# EAGLE design BLE112 Breakout Board v2.2 (EAGLE 7.2.0)
BLE112 Breakout Board v2.0 Full breakout board for all BLE112 functions, with optional LEDs, programming header, USB access, etc.
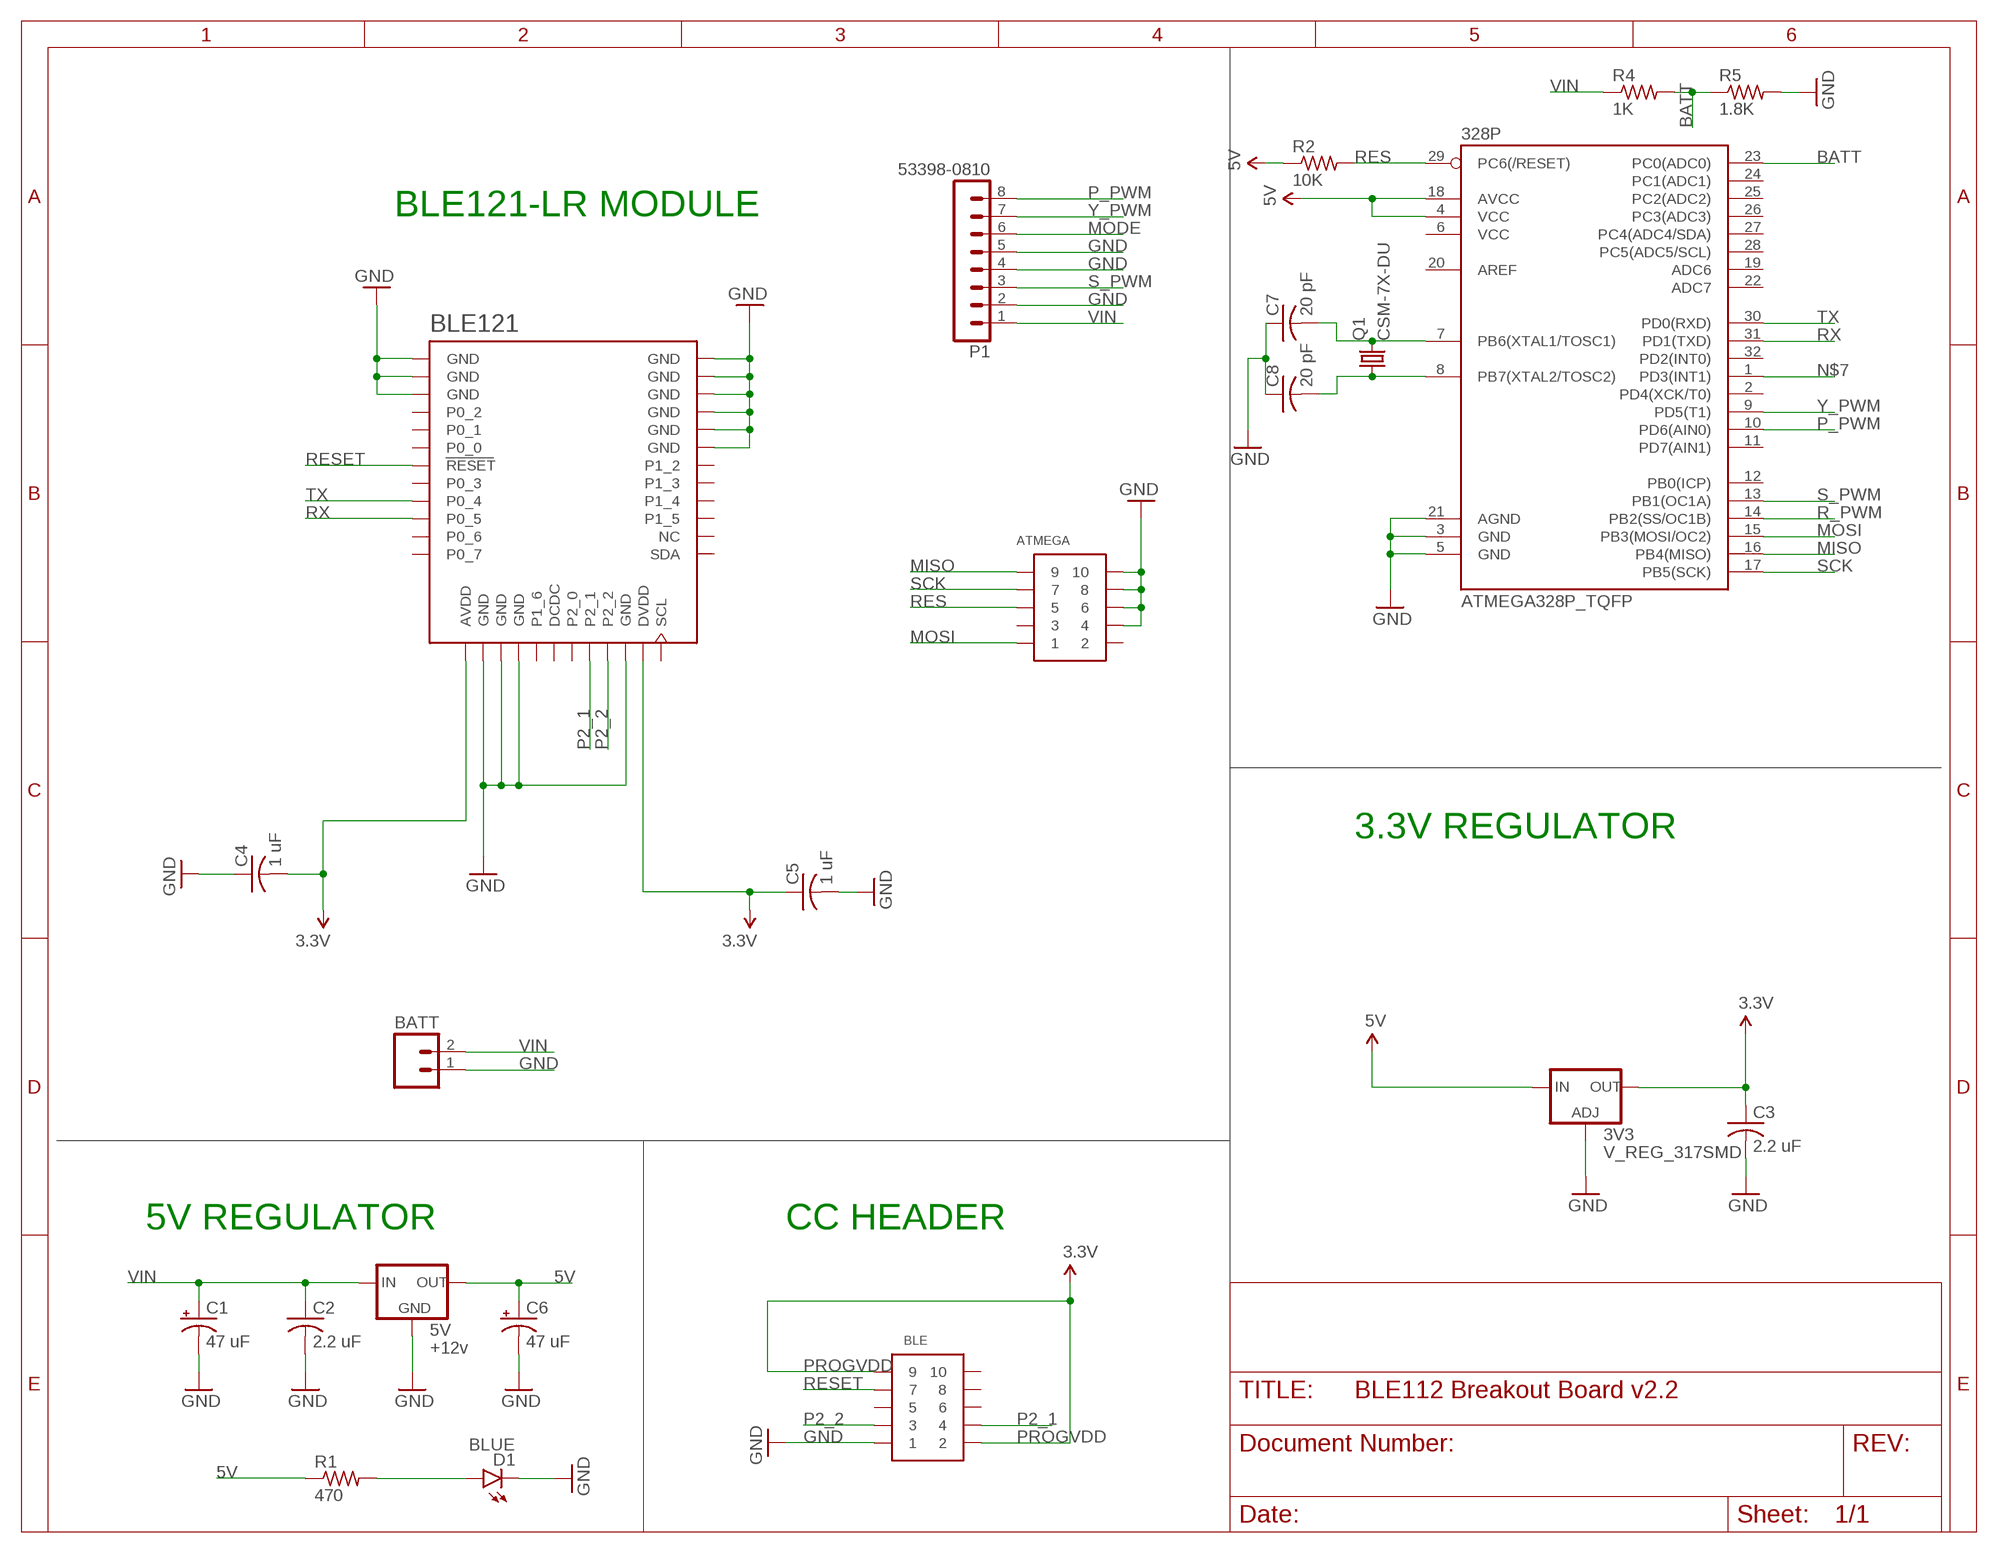
[diagram p0: schematic, sheet 1]

## Parts
3V3  V_REG_317SMD  [SOT223]
5V  +12v  V_REG_78XX7812  [TO-252]
328P  ATMEGA328P_TQFP  [TQFP32-08]
ATMEGA  CONN_5-2-FTSH-V  [FTSH-105-DV]
BATT  M02JST-PTH-2  [JST-2-PTH]
BLE  CONN_5-2-FTSH-V  [FTSH-105-DV]
BLE121  BLE121LR-VISUAL-A  [BLE121LR-A]
C1  47 uF  CPOL-US153CLV-0405  [153CLV-0405]
C2  2.2 uF  C-USC0402  [C0402]
C3  2.2 uF  C-USC0402  [C0402]
C4  1 uF  C-USC0402  [C0402]
C5  1 uF  C-USC0402  [C0402]
C6  47 uF  CPOL-US153CLV-0405  [153CLV-0405]
C7  20 pF  C-USC0402  [C0402]
C8  20 pF  C-USC0402  [C0402]
D1  BLUE  LED-BLUE0603  [LED-0603]
P1  53398-0810  [53398-0810]
Q1  CSM-7X-DU  [CSM-7X-DU]
R1  470  R-US_R0402  [R0402]
R2  10K  R-US_R0402  [R0402]
R4  1K  R-US_R0402  [R0402]
R5  1.8K  R-US_R0402  [R0402]

## Nets
5V [power]: 3V3.3(IN) 5V.2(OUT) 328P.4(VCC) 328P.18(AVCC) C6.+ R1.1 R2.1
BATT: 328P.23(PC0(ADC0)) R4.2 R5.1
GND [power]: 3V3.1(ADJ) 5V.3(GND) 328P.3(GND) 328P.5(GND) 328P.21(AGND) ATMEGA.4 ATMEGA.6 ATMEGA.8 ATMEGA.10 BATT.1 BLE121.GND BLE121.GND@2(GND) BLE121.GND@3(GND) BLE121.GND@4(GND) BLE121.GND@5(GND) BLE121.GND@6(GND) BLE121.GND@7(GND) BLE121.GND@8(GND) BLE121.GND@9(GND) BLE121.GND@10(GND) BLE121.GND@11(GND) BLE121.GND@12(GND) BLE121.GND@13(GND) BLE.1 C1.- C2.2 C3.2 C4.1 C5.2 C6.- C7.1 C8.1 D1.C P1.2 P1.4 P1.5 R5.2
MISO: 328P.16(PB4(MISO)) ATMEGA.9
MODE: P1.6
MOSI: 328P.15(PB3(MOSI/OC2)) ATMEGA.1
N$1: D1.A R1.2
N$2: 328P.7(PB6(XTAL1/TOSC1)) C7.2 Q1.2
N$3: 328P.8(PB7(XTAL2/TOSC2)) C8.2 Q1.1
N$7: 328P.1(PD3(INT1))
P2_1: BLE121.P2_1 BLE.4
P2_2: BLE121.P2_2 BLE.3
P_PWM: 328P.10(PD6(AIN0)) P1.8
PROGVDD [power]: 3V3.2(OUT) BLE121.AVDD BLE121.DVDD BLE.2 BLE.9 C3.1 C4.2 C5.1 ; supply symbol labelled 3.3V
R_PWM: 328P.14(PB2(SS/OC1B))
RES: 328P.29(PC6(/RESET)) ATMEGA.5 R2.2
RESET: BLE121.RESET BLE.7
RX: 328P.31(PD1(TXD)) BLE121.P0_5
S_PWM: 328P.13(PB1(OC1A)) P1.3
SCK: 328P.17(PB5(SCK)) ATMEGA.7
TX: 328P.30(PD0(RXD)) BLE121.P0_4
VIN: 5V.1(IN) BATT.2 C1.+ C2.1 P1.1 R4.1
Y_PWM: 328P.9(PD5(T1)) P1.7
Unconnected: 328P.2(PD4(XCK/T0)) 328P.6(VCC) 328P.11(PD7(AIN1)) 328P.12(PB0(ICP)) 328P.19(ADC6) 328P.20(AREF) 328P.22(ADC7) 328P.24(PC1(ADC1)) 328P.25(PC2(ADC2)) 328P.26(PC3(ADC3)) 328P.27(PC4(ADC4/SDA)) 328P.28(PC5(ADC5/SCL)) 328P.32(PD2(INT0)) ATMEGA.2 ATMEGA.3 BLE121.DCDC BLE121.NC BLE121.P0_0 BLE121.P0_1 BLE121.P0_2 BLE121.P0_3 BLE121.P0_6 BLE121.P0_7 BLE121.P1_2 BLE121.P1_3 BLE121.P1_4 BLE121.P1_5 BLE121.P1_6 BLE121.P2_0 BLE121.SCL BLE121.SDA BLE.5 BLE.6 BLE.8 BLE.10

## Notes on the sheet
- BLE121-LR MODULE
- 3.3V REGULATOR
- 5V REGULATOR | CC HEADER

## Library data of the parts
3V3 = SparkFun-PowerIC:V_REG_317: Voltage Regulator Standard LM317 adjustable voltage regulator. AOI (Adjust Output Input). Google 'LM317 Calculator' for easy to use app to get the two resistor values needed. 240/720 for 5V output. 240/390 for 3.3V output. Spark Fun Electronics SKU : COM-00527
5V = SparkFun-PowerIC:V_REG_78XX: Voltage Regulator Standard 78xx regulator. IGO (Input Ground Output). Spark Fun Electronics SKU : COM-00107; PROD_ID: VREG-12370
328P = SparkFun-DigitalIC:ATMEGA328P_TQFP; PROD_ID: IC-09069
ATMEGA BLE = pel_misc:CONN_5-2
BATT = SparkFun-Connectors:M02: Standard 2-pin 0.1" header. Use with - straight break away headers ( PRT-00116) - right angle break away headers (PRT-00553) - swiss pins (PRT-00743) - machine pins (PRT-00117) - female headers (PRT-00115) Molex polarized connector foot print use with: PRT-08233 with associated crimp pins and housings. 2.54_SCREWTERM for use with PRT-10571. 3.5mm Screw Terminal footprints for PRT-08084 5mm Screw Terminal footprints for use with PRT-08432; PROD_ID: CONN-09863; SKU: PRT-09914
BLE121 = sf-bluegiga:BLE121LR-VISUAL: Bluetooth Low Energy single-mode long-range module - Bluetooth 4.0 (CC2541). BLE121LR-A variant has an on-module ceramic chip antenna. BLE121LR-A variant includes keepout/restrict area. Antenna edge of the module should be flush up against the edge of the PCB. See datasheet for variant layout details. IT IS EXTREMELY IMPORTANT THAT YOU FOLLOW THE LAYOUT GUIDELINES FOR THIS MODULE IN ORDER TO ENSURE MAXIMUM RANGE. THIS MEANS THAT YOU NEED A SOLID GROUND PLANE EXTENDING AT LEAST 17 mm ON THE LEFT AND RIGHT SIDES OF THE MODULE, AS SHOWN IN THE DATASHEET. BLE121LR is a Bluetooth Smart Long Range module targeted for Bluetooth Smart applications where the best possible RF performance and range are required. At +8 dBm TX power and -98 dBm sensitivity BLE121LR has best-in-class RF performance and can provide Bluetooth Smart connectivity up to 450 meters. BLE121LR integrates all features required for a Bluetooth Smart application: Bluetooth radio, software stack and GATT based profiles. and it can also host end user applications, which means no external micro controller is required in size, price or power constrained devices. BLE121LR Bluetooth Smart module also has flexible hardware interfaces to connect to different peripherals or sensors. Although BLE121LR Bluetooth Smart Long Range Module is target for applications requiring high RF performance, it is still has relatively low power consumption and can be power using a standard 3V coin cell batteries. https://www.bluegiga.com/en-US/products/bluetooth-4.0-modules/ble121lr-bluetooth--smart-long https://github.com/jrowberg/sf-oshw Last updated 2014-08-02 by Jeff Rowberg <jeff@rowberg.net>; ANTENNA: On-module ceramic chip antenna
C1 C6 = adafruit:CPOL-US: POLARIZED CAPACITOR, American symbol
C2 C7 C8 = adafruit:C-US: CAPACITOR, American symbol
C3-C5 = resistor:C-US: CAPACITOR, American symbol
D1 = SparkFun-LED:LED-BLUE: Blue LEDs for production use Various blue LEDs stocked by SparkFun production 0603 - DIO-08575 Rebel - DIO-09553 1206 - DIO-09911; PROD_ID: DIO-08575
P1 = con-molex-picoblade:53398-0810: HEADER
Q1 = crystal:CSM-7X-DU: SMD CRYSTAL Source: www.ecsxtal.com .. Crystal 3.6864MHz CSM_7X_DU.PDF; OC_FARNELL: unknown; OC_NEWARK: unknown
R1 = resistor:R-US_: RESISTOR, American symbol
R2 R4 R5 = adafruit:R-US_: RESISTOR, American symbol

## Net classes
0 default: width 0.152 mm, drill 0.33 mm, clearance 0.152 mm
1 power: width 0.254 mm, drill 0.33 mm, clearance 0.152 mm

## Board
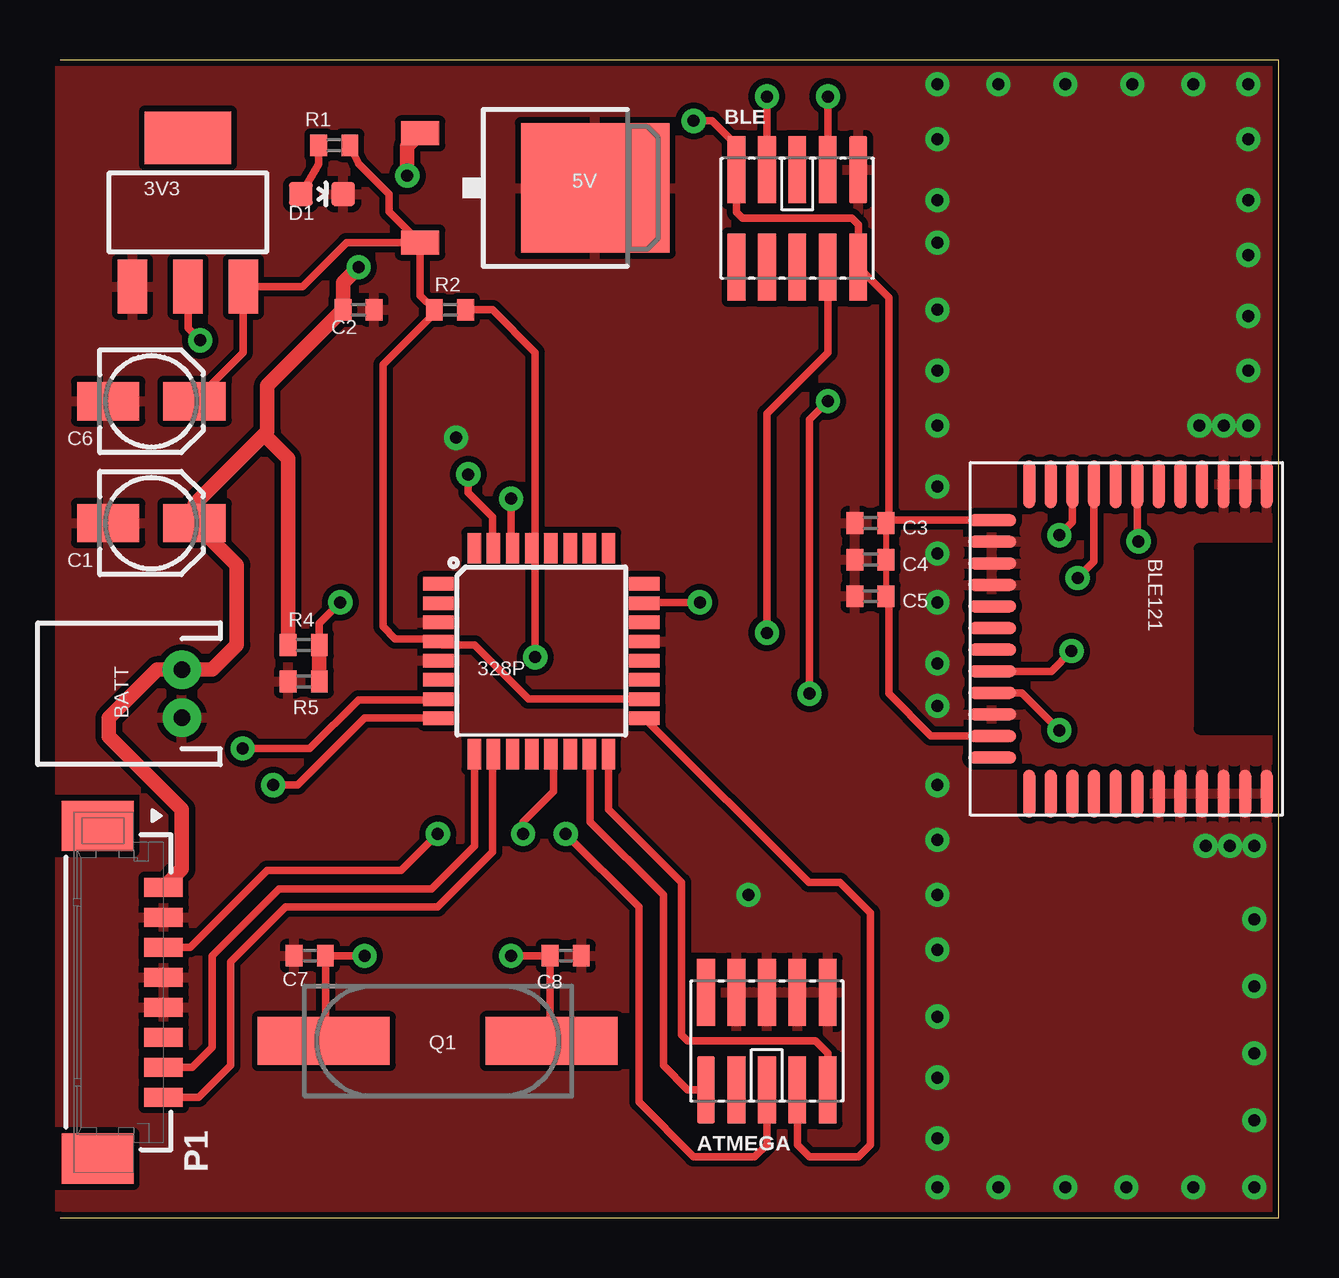
[diagram p1: board, top side]
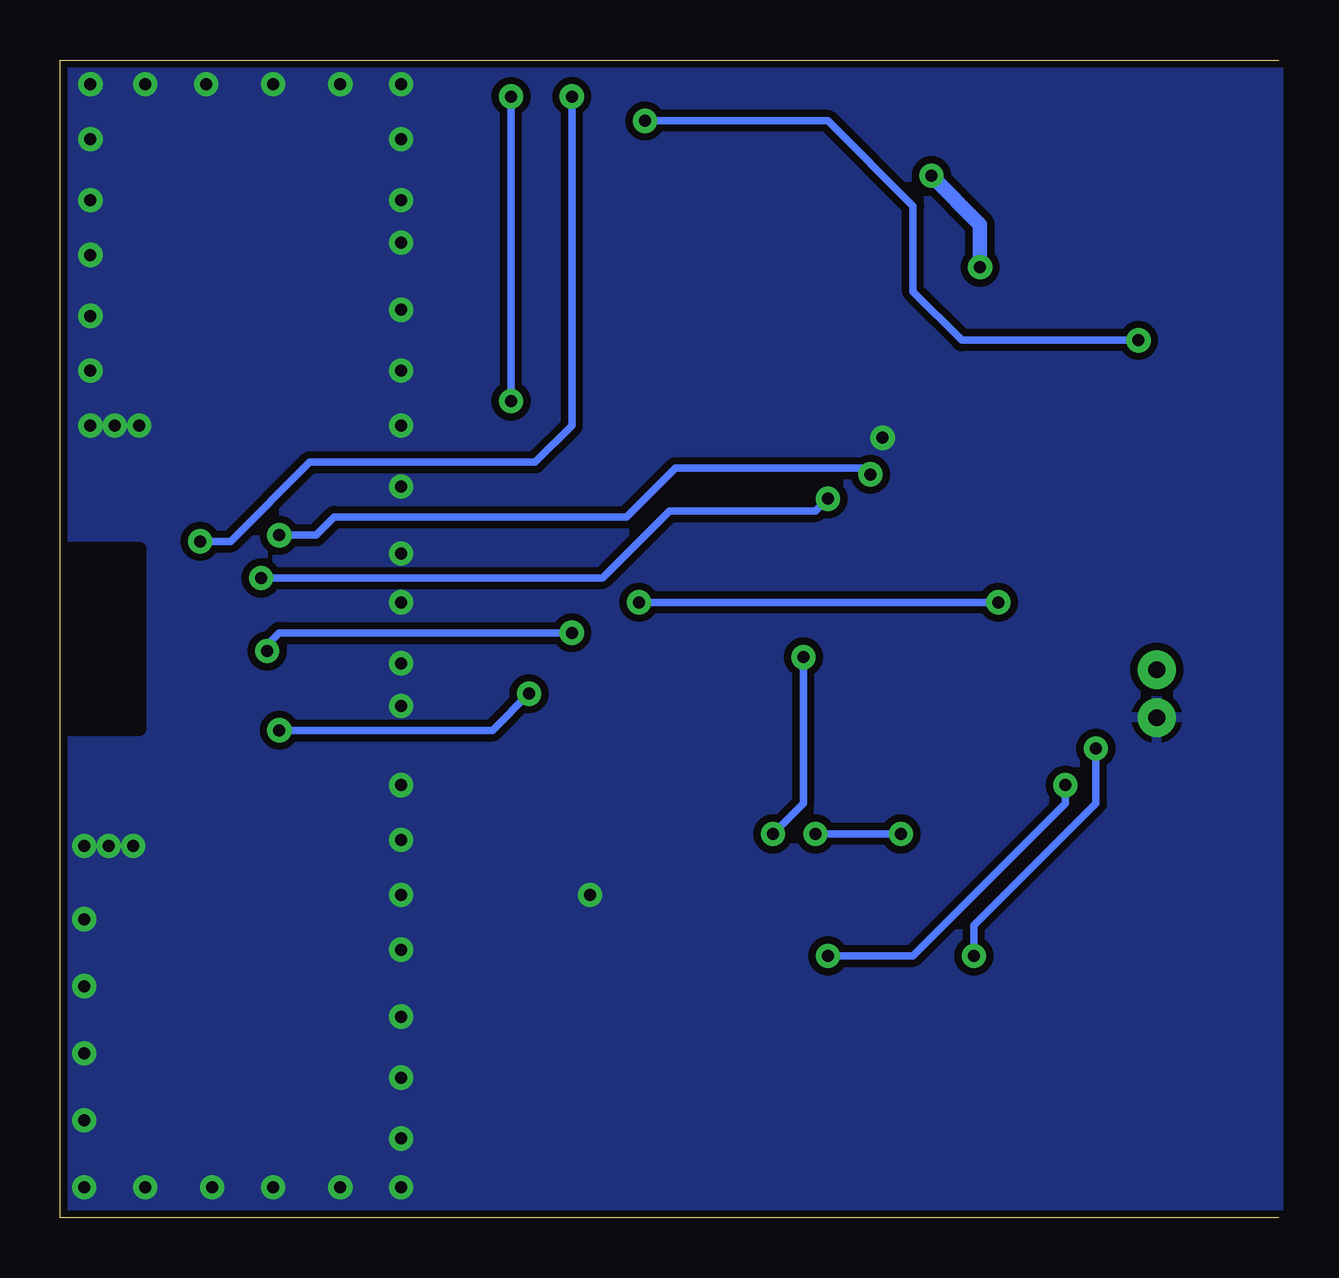
[diagram p2: board, bottom side, seen from below]

Size 50.8 x 48.26 mm. Coordinates in mm from the lower left corner, seen from the top.
Outline: 0,0 50.8,0 50.8,48.26 0,48.26
Copper layers (1*16): Top 0.035mm / dielectric 1.5mm / Bottom 0.035mm
Design rules "SparkFun": minimum track width 8mil, minimum drill 20mil, track to track 8mil, track to pad 8mil, pad to pad 8mil, via to via 8mil, smd to smd 8mil, copper to edge 8mil, drill to drill 8mil, minimum pad ring 12mil, minimum via ring 10mil, stop-mask expansion 4mil, vias tented up to drill 20mil, thermal gap 10mil

### Footprints (pad centres in the part's own frame; a part is rotated, then mirrored left to right if it is on the bottom)
SOT223 = smd 1.219 x 2.235: 1 -2.311,-3.099; 2 0,-3.099; 3 2.311,-3.099 | smd 3.6 x 2.2: 4 0,3.099
TO-252 = smd 1 x 1.6: 1 -2.28,-4.8; 2 2.28,-4.8 | smd 5.4 x 6.2: 3 0,2.5
TQFP32-08 = smd 1.27 x 0.559: 1 -4.293,2.8; 2 -4.293,2; 3 -4.293,1.2; 4 -4.293,0.4; 5 -4.293,-0.4; 6 -4.293,-1.2; 7 -4.293,-2; 8 -4.293,-2.8; 17 4.293,-2.8; 18 4.293,-2; 19 4.293,-1.2; 20 4.293,-0.4; 21 4.293,0.4; 22 4.293,1.2; 23 4.293,2; 24 4.293,2.8 | smd 0.559 x 1.27: 9 -2.8,-4.293; 10 -2,-4.293; 11 -1.2,-4.293; 12 -0.4,-4.293; 13 0.4,-4.293; 14 1.2,-4.293; 15 2,-4.293; 16 2.8,-4.293; 25 2.8,4.293; 26 2,4.293; 27 1.2,4.293; 28 0.4,4.293; 29 -0.4,4.293; 30 -1.2,4.293; 31 -2,4.293; 32 -2.8,4.293
FTSH-105-DV = smd 0.74 x 2.8: 1 -2.54,-2.03; 2 -2.54,2.03; 3 -1.27,-2.03; 4 -1.27,2.03; 5 0,-2.03; 6 0,2.03; 7 1.27,-2.03; 8 1.27,2.03; 9 2.54,-2.03; 10 2.54,2.03
JST-2-PTH = drill 0.7 pad 1.6: 1 -1,0; 2 1,0
BLE121LR-A = smd 0.5 x 2: AVDD -4.95,-5.6; DCDC -0.45,-5.6; DVDD 4.05,-5.6; GND@4 -4.05,-5.6; GND@5 -3.15,-5.6; GND@6 -2.25,-5.6; GND@7 3.15,-5.6; P1_6 -1.35,-5.6; P2_0 0.45,-5.6; P2_1 1.35,-5.6; P2_2 2.25,-5.6; SCL 4.95,-5.6 | smd 2 x 0.5: GND -6.45,5.85; GND@2 -6.45,4.95; GND@3 -6.45,4.05; GND@8 6.45,1.35; GND@9 6.45,2.25; GND@10 6.45,3.15; GND@11 6.45,4.05; GND@12 6.45,4.95; GND@13 6.45,5.85; NC 6.45,-3.15; P0_0 -6.45,1.35; P0_1 -6.45,2.25; P0_2 -6.45,3.15; P0_3 -6.45,-0.45; P0_4 -6.45,-1.35; P0_5 -6.45,-2.25; P0_6 -6.45,-3.15; P0_7 -6.45,-4.05; P1_2 6.45,0.45; P1_3 6.45,-0.45; P1_4 6.45,-1.35; P1_5 6.45,-2.25; RESET -6.45,0.45; SDA 6.45,-4.05
153CLV-0405 = smd 2.6 x 1.6: + 1.8,0; - -1.8,0
C0402 = smd 0.7 x 0.9: 1 -0.65,0; 2 0.65,0
LED-0603 = smd 1 x 1: A 0,-0.877; C 0,0.877
53398-0810 = smd 0.8 x 1.6: 1 4.375,0; 2 3.125,0; 3 1.875,0; 4 0.625,0; 5 -0.625,0; 6 -1.875,0; 7 -3.125,0; 8 -4.375,0 | smd 2.1 x 3: M1 6.935,2.75; M2 -6.935,2.75
CSM-7X-DU = smd 5.5 x 2: 1 -4.75,0; 2 4.75,0
R0402 = smd 0.7 x 0.9: 1 -0.65,0; 2 0.65,0

### Placement (x,y rotation side)
3V3  5.33,41.91 0 top
5V  19.81,42.93 270 top
328P  20.07,23.62 0 top
ATMEGA  29.46,7.37 0 top
BATT  5.08,21.84 90 top
BLE  30.73,41.66 180 top
BLE121  44.45,24.13 270 top
C1  3.81,28.96 0 top
C2  12.45,37.85 0 top
C3  33.78,28.96 180 top
C4  33.78,27.43 0 top
C5  33.78,25.91 180 top
C6  3.81,34.04 0 top
C7  10.41,10.92 0 top
C8  21.08,10.92 180 top
D1  10.92,42.67 270 top
P1  4.32,9.4 90 top
Q1  15.75,7.37 180 top
R1  11.43,44.7 180 top
R2  16.26,37.85 0 top
R4  10.16,23.88 0 top
R5  10.16,22.35 180 top

### Tracks (layer width: path | path; a pad name or v marks a point on that pad's centre or on a via)
5V
  Top 0.305: C6.+ 7.64,36.07 3V3.3 10.11,38.81 11.94,40.64 5V.2 | R1.1 12.45,43.94 13.72,42.67 13.72,41.94 5V.2 | 5V.2 15.01,38.44 R2.1 15.61,37.7 13.46,35.56 13.46,24.64 13.97,24.13 15.66,24.13 328P.4 15.92,23.88 17.27,23.88 19.53,21.62 328P.18
BATT  (via drill 0.5)
  Top 0.305: R4.2 10.81,24.78 v11.68,25.65 | v26.67,25.65 24.39,25.65 328P.23
  Top 0.61: R4.2 R5.1
  Bottom 0.305: v11.68,25.65 v26.67,25.65
GND  (via drill 0.5)
  other vias: 36.58,40.64 36.58,42.42 47.5,33.02 48.51,33.02 49.53,33.02 49.53,35.31 49.53,37.59 49.53,40.13 49.53,42.42 49.53,47.24 47.24,47.24 44.7,47.24 41.91,47.24 39.12,47.24 36.58,47.24 36.58,44.96 36.58,13.46 36.58,11.18 36.58,8.38 36.58,5.84 36.58,3.3 36.58,1.27 39.12,1.27 41.91,1.27 44.45,1.27 47.24,1.27 49.78,1.27 49.78,4.06 49.78,6.86 49.78,9.65 49.78,12.45 49.78,15.49 48.77,15.49 47.75,15.49 36.58,15.75 36.58,35.31 36.58,37.85 49.53,44.96 36.58,33.02 36.58,30.48 36.58,27.69 36.58,25.65 36.58,23.11 36.58,21.34 36.58,18.03 28.7,13.46 16.51,32.51
  pour Top (isolate 0.254): 0,48.26 50.8,48.26 50.8,0 0,0
  pour Bottom (isolate 0.305): 0,48.26 50.8,48.26 50.8,0 0,0
MISO
  Top 0.305: ATMEGA.9 32,6.86 31.5,7.37 26.16,7.37 25.91,7.62 25.91,13.97 22.86,17.02 328P.16
MOSI
  Top 0.305: ATMEGA.1 26.16,5.34 25.15,6.35 25.15,13.46 22.1,16.51 22.1,19.3 328P.15
N$1
  Top 0.305: R1.2 10.78,43.91 D1.A
N$2  (via drill 0.5)
  Top 0.305: Q1.2 11.06,7.43 C7.2 v12.7,10.92 | v7.62,19.56 10.41,19.56 12.45,21.59 15.74,21.59 328P.7
  Bottom 0.305: v12.7,10.92 12.7,12.19 7.62,17.27 v7.62,19.56
N$3  (via drill 0.5)
  Top 0.305: Q1.1 20.43,7.43 C8.2 v18.8,10.92 | v8.89,18.03 9.91,18.03 12.7,20.83 328P.8
  Bottom 0.305: v18.8,10.92 15.24,10.92 8.89,17.27 v8.89,18.03
P2_1  (via drill 0.5)
  Top 0.305: BLE121.P2_1 41.32,22.78 v42.16,23.62 | v29.46,24.38 29.46,33.53 32,36.07 BLE.4
  Bottom 0.305: v42.16,23.62 42.16,23.88 41.66,24.38 v29.46,24.38
P2_2  (via drill 0.5)
  Top 0.305: BLE121.P2_2 40.1,21.88 v41.66,20.32 | v31.24,21.84 31.24,33.27 v32,34.04 | v32,46.74 BLE.3
  Bottom 0.305: v41.66,20.32 32.77,20.32 v31.24,21.84 | v32,34.04 v32,46.74
P_PWM
  Top 0.305: P1.8 5.79,5.02 7.11,6.35 7.11,10.67 9.4,12.95 15.75,12.95 18.03,15.24 18.03,19.3 328P.10
PROGVDD  (via drill 0.5)
  Top 0.254: C3.1 C4.2 C5.1
  Top 0.305: 3V3.2 5.33,37.08 v5.84,36.58 | v26.42,45.72 27.18,45.72 28.19,44.7 BLE.9 28.19,41.91 28.45,41.66 33.02,41.66 33.27,41.4 BLE.2 34.56,38.34 34.56,29.08 | BLE121.DVDD 36.31,20.08 34.54,21.84 34.54,25.8 C5.1 | BLE121.AVDD 34.56,29.08 | 34.56,29.08 C3.1
  Bottom 0.305: v5.84,36.58 13.21,36.58 15.24,38.61 15.24,42.16 18.8,45.72 v26.42,45.72
RES  (via drill 0.5)
  Top 0.305: ATMEGA.5 29.46,3.05 28.96,2.54 26.42,2.54 24.13,4.83 24.13,12.95 v21.08,16 | v19.81,23.37 19.81,27.77 328P.29 19.81,28.06 19.81,36.07 18.03,37.85 R2.2
  Bottom 0.305: v21.08,16 19.81,17.27 v19.81,23.37
RESET  (via drill 0.5)
  Top 0.305: BLE121.RESET 44.9,28.25 v44.96,28.19 | v29.46,46.74 BLE.7
  Bottom 0.305: v44.96,28.19 43.69,28.19 40.39,31.5 30.99,31.5 29.46,33.02 v29.46,46.74
RX  (via drill 0.5)
  Top 0.305: BLE121.P0_5 42.2,28.99 v41.66,28.45 | v17.02,30.99 17.02,30.23 18.03,29.21 18.03,27.95 328P.31
  Bottom 0.305: v41.66,28.45 40.13,28.45 39.37,29.21 27.18,29.21 25.15,31.24 17.27,31.24 v17.02,30.99
S_PWM  (via drill 0.5)
  Top 0.305: P1.3 5.43,11.27 8.64,14.48 14.22,14.48 v15.75,16 | v19.3,16 19.3,16.51 20.57,17.78 20.57,19.22 328P.13
  Bottom 0.305: v15.75,16 v19.3,16
SCK
  Top 0.305: ATMEGA.7 30.73,3.05 31.24,2.54 33.27,2.54 33.78,3.05 33.78,12.7 32.51,13.97 31.21,13.97 328P.17
TX  (via drill 0.5)
  Top 0.305: BLE121.P0_4 43.1,27.35 v42.42,26.67 | v18.8,29.97 18.8,27.98 328P.30
  Bottom 0.305: v42.42,26.67 28.19,26.67 25.4,29.46 19.3,29.46 v18.8,29.97
VIN  (via drill 0.5)
  Top 0.61: 8.51,32.64 5.61,29.74 C1.+ 7.37,27.2 7.37,23.88 6.33,22.84 BATT.2 4.05,22.84 2.03,20.83 2.03,20.07 5.08,17.02 5.08,14.54 P1.1 | 8.51,32.64 8.64,32.77 8.64,34.69 C2.1 11.8,38.97 v12.45,39.62 | v14.48,43.43 14.48,44.67 5V.1 | R4.1 9.51,31.64 8.51,32.64
  Bottom 0.61: v12.45,39.62 12.45,41.4 v14.48,43.43
Y_PWM
  Top 0.305: P1.7 5.51,6.27 6.35,7.11 6.35,10.92 9.14,13.72 15.49,13.72 17.27,15.49 328P.9